# Altium schematic sheet TPS62177DQCR.schdoc
size 124 x 99 mm
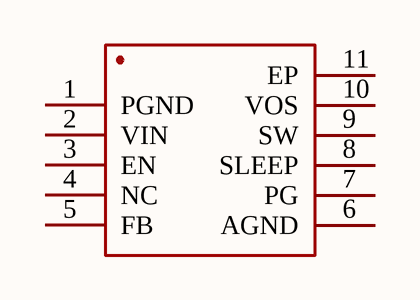
[diagram p0: TPS62177DQCR.schdoc]

## Parts
U?  TPS62177DQCR  [WSON-10_L3.0-W2.0-P0.50-BL-EP]  (value not drawn)

## Nets

Not connected (* = marked no-connect by the designer): U? 1(PGND) 2(VIN) 3(EN) 4(NC) 5(FB) 6(AGND) 7(PG) 8(SLEEP) 9(SW) 10(VOS) 11(EP)

## Library data of the parts
U? = TPS62177DQCR: Manufacturer: TI(德州仪器); Add into BOM: yes; Function: Step-down type; Switch tube (built-in/external): 内置; Symbol: TPS62177DQCR; Device: TPS62177DQCR; LCSC Part Name: TPS62177DQCR; Supplier Part: C91241; Manufacturer Part: TPS62177DQCR; Supplier Footprint: WSON-10-EP(2x3); JLCPCB Part Class: Extended Part; Datasheet: https://www.ti.com/cn/lit/gpn/tps62177; Supplier: LCSC; Convert to PCB: yes; Input Voltage: -; Output Current (Max): -; Switching Frequency: -; Synchronous Rectification: -; Number of Outputs: -; Topology: -